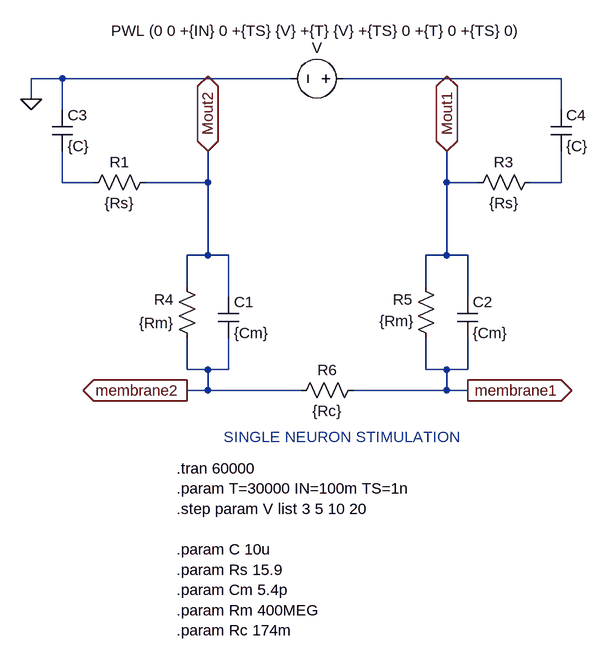
[diagram p0: schematic Model1.asc]
Model1.asc, the LTspice schematic file:
Version 4
SHEET 1 1512 840
WIRE -64 0 -112 0
WIRE 288 0 -64 0
WIRE 704 0 368 0
WIRE -112 32 -112 0
WIRE -64 48 -64 0
WIRE 704 48 704 0
WIRE -64 160 -64 112
WIRE -16 160 -64 160
WIRE 160 160 160 112
WIRE 160 160 64 160
WIRE 528 160 528 112
WIRE 576 160 528 160
WIRE 704 160 704 112
WIRE 704 160 656 160
WIRE 160 272 160 160
WIRE 160 272 128 272
WIRE 192 272 160 272
WIRE 528 272 528 160
WIRE 528 272 496 272
WIRE 560 272 528 272
WIRE 128 320 128 272
WIRE 496 320 496 272
WIRE 192 336 192 272
WIRE 560 336 560 272
WIRE 128 448 128 400
WIRE 160 448 128 448
WIRE 192 448 192 400
WIRE 192 448 160 448
WIRE 496 448 496 400
WIRE 528 448 496 448
WIRE 560 448 560 400
WIRE 560 448 528 448
WIRE 160 480 160 448
WIRE 160 480 128 480
WIRE 304 480 160 480
WIRE 528 480 528 448
WIRE 528 480 384 480
WIRE 560 480 528 480
FLAG 560 480 membrane1
IOPIN 560 480 Out
FLAG 128 480 membrane2
IOPIN 128 480 Out
FLAG -112 32 0
FLAG 528 112 Mout1
IOPIN 528 112 BiDir
FLAG 160 112 Mout2
IOPIN 160 112 BiDir
SYMBOL res 80 144 R90
WINDOW 0 0 56 VBottom 2
WINDOW 3 32 56 VTop 2
SYMATTR InstName R1
SYMATTR Value {Rs}
SYMBOL res 672 144 R90
WINDOW 0 0 56 VBottom 2
WINDOW 3 32 56 VTop 2
SYMATTR InstName R3
SYMATTR Value {Rs}
SYMBOL res 144 416 R180
WINDOW 0 36 76 Left 2
WINDOW 3 36 40 Left 2
SYMATTR InstName R4
SYMATTR Value {Rm}
SYMBOL res 512 416 R180
WINDOW 0 36 76 Left 2
WINDOW 3 34 43 Left 2
SYMATTR InstName R5
SYMATTR Value {Rm}
SYMBOL cap 176 336 R0
SYMATTR InstName C1
SYMATTR Value {Cm}
SYMBOL cap 544 336 R0
SYMATTR InstName C2
SYMATTR Value {Cm}
SYMBOL res 400 464 R90
WINDOW 0 0 56 VBottom 2
WINDOW 3 32 56 VTop 2
SYMATTR InstName R6
SYMATTR Value {Rc}
SYMBOL voltage 384 0 R90
WINDOW 0 -32 56 VBottom 2
WINDOW 3 -89 53 VTop 2
SYMATTR InstName V
SYMATTR Value PWL (0 0 +{IN} 0 +{TS} {V} +{T} {V} +{TS} 0 +{T} 0 +{TS} 0)
SYMBOL cap -80 48 R0
SYMATTR InstName C3
SYMATTR Value {C}
SYMBOL cap 688 48 R0
SYMATTR InstName C4
SYMATTR Value {C}
TEXT 112 600 Left 2 !.tran 60000\n.param T=30000 IN=100m TS=1n\n.step param V list 3 5 10 20\n \n.param C 10u\n.param Rs 15.9\n.param Cm 5.4p \n.param Rm 400MEG\n.param Rc 174m
TEXT 184 552 Left 2 ;SINGLE NEURON STIMULATION

The netlist it stands for:
* Model1.asc
R1 Mout2 N002 {Rs}
R3 N003 Mout1 {Rs}
R4 membrane2 Mout2 {Rm}
R5 membrane1 Mout1 {Rm}
C1 Mout2 membrane2 {Cm}
C2 Mout1 membrane1 {Cm}
R6 membrane1 membrane2 {Rc}
V N001 0 PWL (0 0 +{IN} 0 +{TS} {V} +{T} {V} +{TS} 0 +{T} 0 +{TS} 0)
C3 0 N002 {C}
C4 N001 N003 {C}
.tran 60000
.param T=30000 IN=100m TS=1n
.step param V list 3 5 10 20
.param C 10u
.param Rs 15.9
.param Cm 5.4p
.param Rm 400MEG
.param Rc 174m
* SINGLE NEURON STIMULATION
.backanno
.end